# EAGLE design piezo-buffer-and-preamp-ritter_V0-2alt (EAGLE 7.5.0)
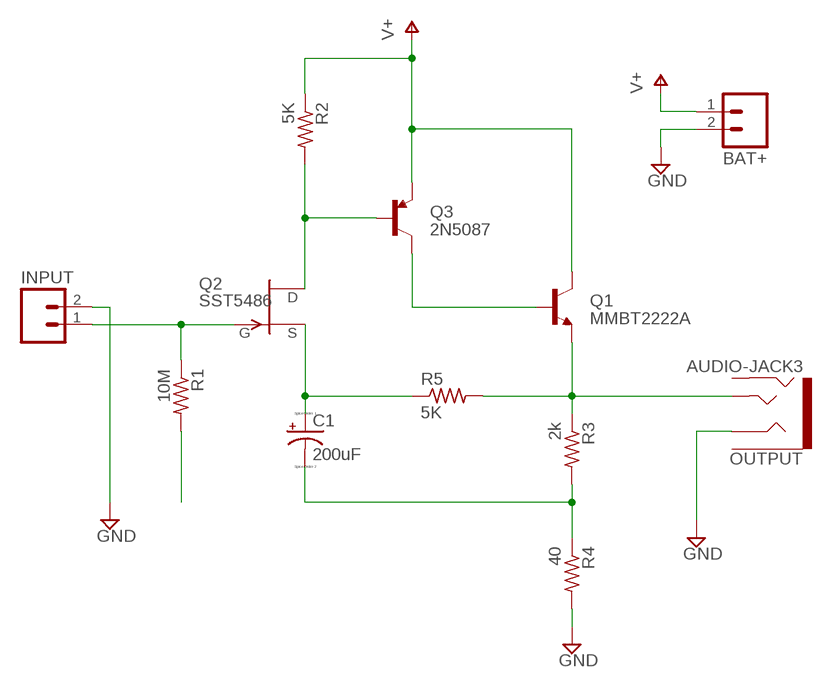
[diagram p0: schematic, sheet 1]

## Parts
BAT+  M02LOCK  [1X02_LOCK]
C1  200uF  CPOL-US153CLV-0810  [153CLV-0810]
INPUT  M02LOCK  [1X02_LOCK]
OUTPUT  AUDIO-JACK3  [AUDIO-JACK-TRRS-SMD]
Q1  MMBT2222A  TRANSISTOR_NPN  [SOT23]
Q2  SST5486  [SOT23]
Q3  2N5087  TRANSISTOR_PNP  [SOT23]
R1  10M  R-US_R0805  [R0805]
R2  5K  R-US_R0805  [R0805]
R3  2k  R-US_R0805  [R0805]
R4  40  R-US_R0805  [R0805]
R5  5K  R-US_R0805  [R0805]

## Nets
GND: BAT+.2 INPUT.2 OUTPUT.RING1 R4.2
N$1: INPUT.1 Q2.3(G) R1.1
N$2: Q2.1(D) Q3.1(B) R2.2
N$3: OUTPUT.TIP Q1.2(E) R3.1 R5.2
N$4: C1.- R3.2 R4.1
N$5: Q1.1(B) Q3.3(C)
N$6: C1.+ Q2.2(S) R5.1
N$7: R1.2
V+: BAT+.1 Q1.3(C) Q3.2(E) R2.1
Unconnected: OUTPUT.EARTH OUTPUT.RING2

## Library data of the parts
BAT+ INPUT = CMU-ArtFab:M02: Header 2 Standard 2-pin 0.1" header. Use with straight break away headers (SKU : PRT-00116), right angle break away headers (PRT-00553), swiss pins (PRT-00743), machine pins (PRT-00117), and female headers (PRT-00115). Molex polarized connector foot print use with SKU : PRT-08233 with associated crimp pins and housings.
C1 = resistor:CPOL-US: POLARIZED CAPACITOR, American symbol
OUTPUT = SparkFun-Connectors:AUDIO-JACK3: Audio jack - 3.5mm TRRS variety - two rings.
Q1 = CMU-ArtFab:TRANSISTOR_NPN: Generic NPN BJT MMBT2222A - TRANS-08049 (SOT-23, 1A 40V) MPSA42 - TRANS-09116 (SOT-23, 500mA 300V) MMBT5088LT1G - TRANS-11160 (SOT-23, 50 mA 30V) BC547 - COM-08928 <http://www.sparkfun.com/products/8928> (TO-92 45V 100mA) (1.Collector 2.Base 3.Emitter) 2N3904 - COM-00521 <http://www.sparkfun.com/products/521> (TO-92 40V 200mA) (1.Emitter 2.Base 3.Collector) P2N2222A - COM-12852 <http://www.sparkfun.com/products/12852> (TO-92 40V 600mA) (1.Collector 2.Base 3.Emitter)
Q2 = transistor-fet:?548*: N-Channel JFETs Source: VISHAY 2N5484.pdf Compatible: TO92 2N5245 J304 J305 U310 J308 J309 J310 TO72 2N4416 2N4416A 2N3823 2N4351 3N169 3N170 3N171 MFE3002 TO18 2N3796 2N3797 MFE825 Source: Motorola European Master Guide Pacge 3-59
Q3 = CMU-ArtFab:TRANSISTOR_PNP: Generic PNP BJT Double check pinouts against datasheets- not all devices are the same! MMBT3906 - 40V 200mA SOT-23 (TRANS-08052) MMBT4403 - 40V 600mA SOT-23 (TRANS-09245)
R1-R5 = resistor:R-US_: RESISTOR, American symbol

## Board
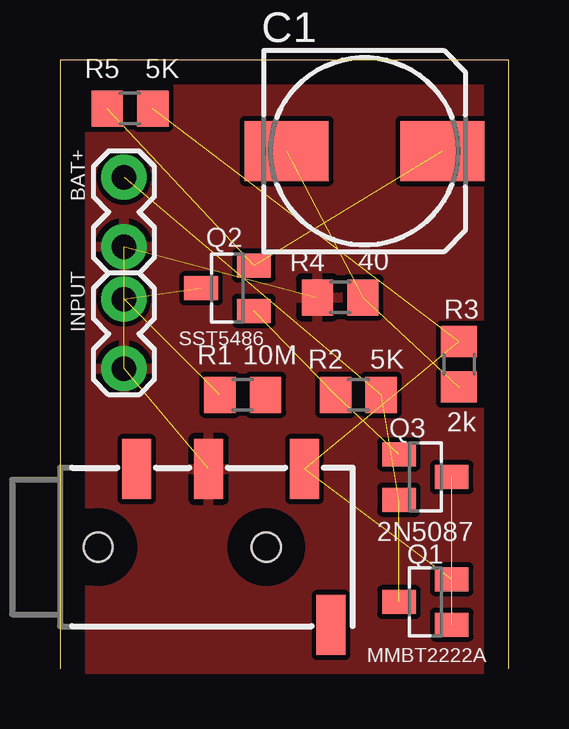
[diagram p1: board, top side]
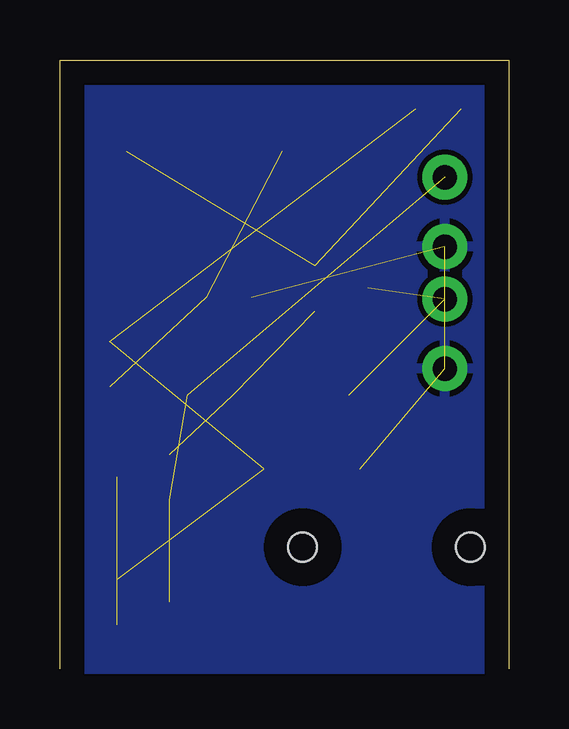
[diagram p2: board, bottom side, seen from below]

Size 18.72 x 25.39 mm. Coordinates in mm from the lower left corner, seen from the top.
Outline: 18.72,0 18.72,25.39 0,25.39 0,0
Copper layers (1*16): Top 0.035mm / dielectric 1.5mm / Bottom 0.035mm
Design rules "default": minimum track width 10mil, minimum drill 24mil, track to track 8mil, track to pad 8mil, pad to pad 8mil, via to via 8mil, smd to smd 8mil, copper to edge 40mil, drill to drill 8mil, minimum pad ring 10mil, minimum via ring 8mil, stop-mask expansion 4mil, vias tented up to drill 0mil, thermal gap 10mil

### Footprints (pad centres in the part's own frame; a part is rotated, then mirrored left to right if it is on the bottom)
1X02_LOCK = drill 1.016 pad 1.88: 1 -0.178,0; 2 2.718,0
153CLV-0810 = smd 3.5 x 2.5: + 3.25,0; - -3.25,0
AUDIO-JACK-TRRS-SMD = smd 1.2 x 2.5: EARTH 11.3,-3.25; RING1 6.2,3.25; RING2 3.2,3.25; TIP 10.2,3.25 | hole 1.2: 1.6,0; 8.6,0
SOT23 = smd 1 x 1.4: 1 -0.95,-1.1; 2 0.95,-1.1; 3 0,1.1
R0805 = smd 1.3 x 1.5: 1 -0.95,0; 2 0.95,0

### Placement (x,y rotation side)
BAT+  2.67,20.32 270 top
C1  12.7,21.59 0 top
INPUT  2.67,15.24 270 top
OUTPUT  0,5.08 0 top
Q1  15.24,2.79 90 top
Q2  6.99,15.88 90 top
Q3  15.24,8 270 top
R1  7.62,11.43 0 top
R2  12.45,11.43 180 top
R3  16.64,12.7 270 top
R4  11.68,15.49 180 top
R5  2.92,23.37 0 top

### Tracks (layer width: path | path; a pad name or v marks a point on that pad's centre or on a via)
GND  (3 unrouted)
  pour Top: 0,0 19.05,0 19.05,25.4 0,25.4
  pour Bottom: 0,25.4 19.05,25.4 19.05,0 0,0
N$1  (2 unrouted)
N$2  (2 unrouted)
N$3  (3 unrouted)
N$4  (2 unrouted)
N$5  (1 unrouted)
N$6  (2 unrouted)
V+  (3 unrouted)